# Altium schematic sheet BLM21PG221SN1D1_BLM21PG221SN1D.schdoc
size 127 x 99 mm
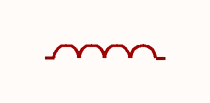
[diagram p0: BLM21PG221SN1D1_BLM21PG221SN1D.schdoc]

## Parts
L?  BLM21PG221SN1D  [L0805]  (value not drawn)

## Nets

Not connected (* = marked no-connect by the designer): L? 1 2

## Library data of the parts
L? = BLM21PG221SN1D: Manufacturer: muRata(村田); Add into BOM: yes; Impedance @ Frequency: 220Ω@100MHz; Tolerance: ±25%; DC Resistance: 45mΩ; Current Rating: 2A; Circuits: 1; Symbol: BLM21PG221SN1D; Device: BLM21PG221SN1D; LCSC Part Name: 单路 0805磁珠 阻抗220Ω@100MHz; Supplier Part: C85840; Manufacturer Part: BLM21PG221SN1D; Supplier Footprint: 0805; JLCPCB Part Class: Extended Part; Datasheet: https://atta.szlcsc.com/upload/public/pdf/source/20180326/C118443_3FAC30E9A4F0E6B81275543C61E0685E.pdf; Supplier: LCSC; Convert to PCB: yes